# Altium schematic sheet BarGraph.SchDoc
size A
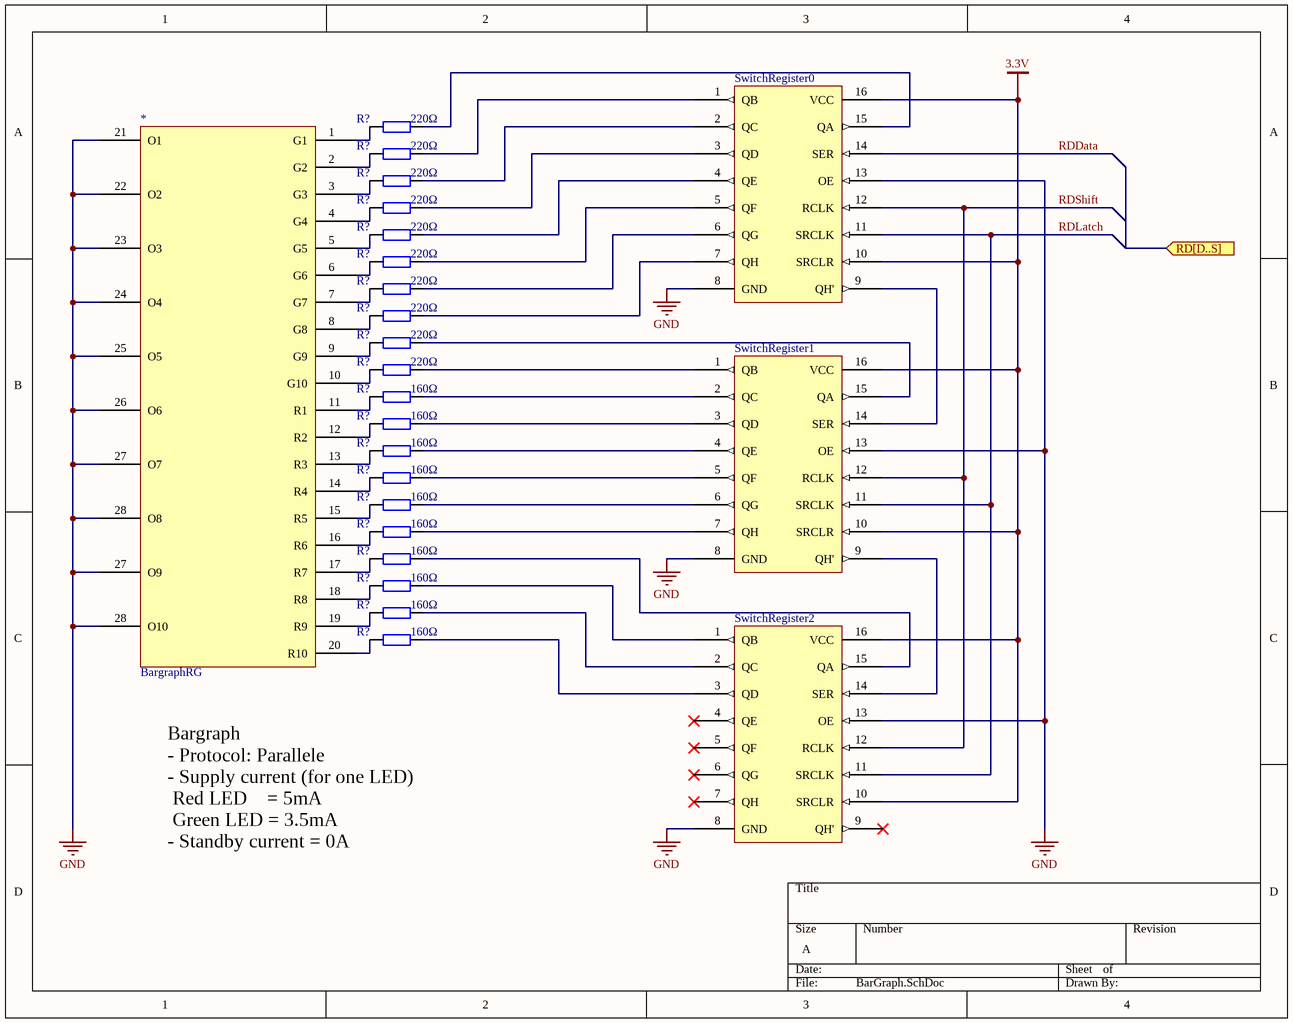
[diagram p0: BarGraph.SchDoc]

## Parts
(Parts that share a designator on the sheet are numbered #1, #2 ... from top to bottom, then left to right.)
*  BargraphRG
R?#1  220Ω  [AXIAL-0.4]
R?#2  220Ω  [AXIAL-0.4]
R?#3  220Ω  [AXIAL-0.4]
R?#4  220Ω  [AXIAL-0.4]
R?#5  220Ω  [AXIAL-0.4]
R?#6  220Ω  [AXIAL-0.4]
R?#7  220Ω  [AXIAL-0.4]
R?#8  220Ω  [AXIAL-0.4]
R?#9  220Ω  [AXIAL-0.4]
R?#10  220Ω  [AXIAL-0.4]
R?#11  160Ω  [AXIAL-0.4]
R?#12  160Ω  [AXIAL-0.4]
R?#13  160Ω  [AXIAL-0.4]
R?#14  160Ω  [AXIAL-0.4]
R?#15  160Ω  [AXIAL-0.4]
R?#16  160Ω  [AXIAL-0.4]
R?#17  160Ω  [AXIAL-0.4]
R?#18  160Ω  [AXIAL-0.4]
R?#19  160Ω  [AXIAL-0.4]
R?#20  160Ω  [AXIAL-0.4]
SwitchRegister0  (no value)
SwitchRegister1  (no value)
SwitchRegister2  (no value)

## Ports
RD[D..S] (in)

## Nets
3.3V: SwitchRegister0.10(SRCLR) SwitchRegister0.16(VCC) SwitchRegister1.10(SRCLR) SwitchRegister1.16(VCC) SwitchRegister2.10(SRCLR) SwitchRegister2.16(VCC)
GND: *.21(O1) *.22(O2) *.23(O3) *.24(O4) *.25(O5) *.26(O6) *.27(O7) *.28(O8) SwitchRegister0.8(GND) SwitchRegister0.13(OE) SwitchRegister1.8(GND) SwitchRegister1.13(OE) SwitchRegister2.8(GND) SwitchRegister2.13(OE)
RDData: SwitchRegister0.14(SER)
RDLatch: SwitchRegister0.11(SRCLK) SwitchRegister1.11(SRCLK) SwitchRegister2.11(SRCLK)
RDShift: SwitchRegister0.12(RCLK) SwitchRegister1.12(RCLK) SwitchRegister2.12(RCLK)
Net*_1: *.1(G1) R?#1.1
Net*_2: *.2(G2) R?#2.1
Net*_3: *.3(G3) R?#3.1
Net*_4: *.4(G4) R?#4.1
Net*_5: *.5(G5) R?#5.1
Net*_6: *.6(G6) R?#6.1
Net*_7: *.7(G7) R?#7.1
Net*_8: *.8(G8) R?#8.1
Net*_9: *.9(G9) R?#9.1
Net*_10: *.10(G10) R?#10.1
Net*_11: *.11(R1) R?#11.1
Net*_12: *.12(R2) R?#12.1
Net*_13: *.13(R3) R?#13.1
Net*_14: *.14(R4) R?#14.1
Net*_15: *.15(R5) R?#15.1
Net*_16: *.16(R6) R?#16.1
Net*_17: *.17(R7) R?#17.1
Net*_18: *.18(R8) R?#18.1
Net*_19: *.19(R9) R?#19.1
Net*_20: *.20(R10) R?#20.1
NetR?#1_2: R?#1.2 SwitchRegister0.15(QA)
NetR?#2_2: R?#2.2 SwitchRegister0.1(QB)
NetR?#3_2: R?#3.2 SwitchRegister0.2(QC)
NetR?#4_2: R?#4.2 SwitchRegister0.3(QD)
NetR?#5_2: R?#5.2 SwitchRegister0.4(QE)
NetR?#6_2: R?#6.2 SwitchRegister0.5(QF)
NetR?#7_2: R?#7.2 SwitchRegister0.6(QG)
NetR?#8_2: R?#8.2 SwitchRegister0.7(QH)
NetR?#9_2: R?#9.2 SwitchRegister1.15(QA)
NetR?#10_2: R?#10.2 SwitchRegister1.1(QB)
NetR?#11_2: R?#11.2 SwitchRegister1.2(QC)
NetR?#12_2: R?#12.2 SwitchRegister1.3(QD)
NetR?#13_2: R?#13.2 SwitchRegister1.4(QE)
NetR?#14_2: R?#14.2 SwitchRegister1.5(QF)
NetR?#15_2: R?#15.2 SwitchRegister1.6(QG)
NetR?#16_2: R?#16.2 SwitchRegister1.7(QH)
NetR?#17_2: R?#17.2 SwitchRegister2.15(QA)
NetR?#18_2: R?#18.2 SwitchRegister2.1(QB)
NetR?#19_2: R?#19.2 SwitchRegister2.2(QC)
NetR?#20_2: R?#20.2 SwitchRegister2.3(QD)
NetSwitchRegister0_9: SwitchRegister0.9(QH') SwitchRegister1.14(SER)
NetSwitchRegister1_9: SwitchRegister1.9(QH') SwitchRegister2.14(SER)

Not connected (* = marked no-connect by the designer): SwitchRegister2 4(QE)* 5(QF)* 6(QG)* 7(QH)* 9(QH')*

## Notes on the sheet
- Bargraph
  - Protocol: Parallele
  - Supply current (for one LED)
  Red LED    = 5mA
  Green LED = 3.5mA
  - Standby current = 0A

## Library data of the parts
R?#1-R?#20 = Res2: Resistor; Value: 1K; Published: 8-Jun-2000; LatestRevisionDate: 17-Jul-2002; LatestRevisionNote: Re-released for DXP Platform.; PackageReference: AXIAL-0.4; Publisher: Altium Limited; PackageDescription: Axial Device, Thru-Hole; 2 Leads; 0.4 in Pin Spacing
SwitchRegister0-SwitchRegister2 = Component_1